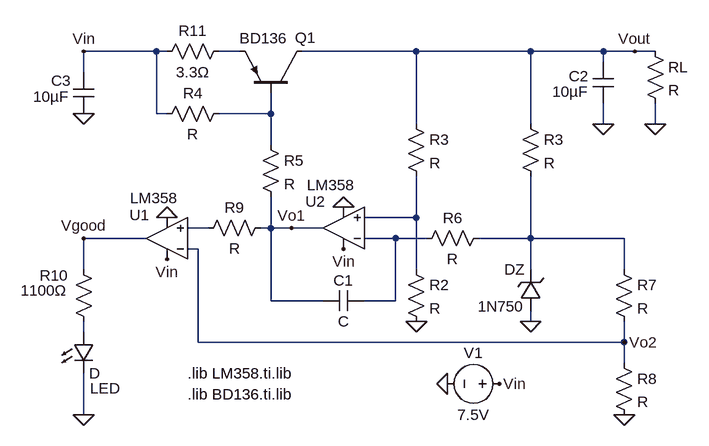
[diagram p0: schematic Lab 2 - t.asc]
Lab 2 - t.asc, the LTspice schematic file:
Version 4
SHEET 1 880 680
WIRE 48 48 -64 48
WIRE 64 48 48 48
WIRE 176 48 144 48
WIRE 448 48 272 48
WIRE 624 48 448 48
WIRE 736 48 624 48
WIRE 784 48 736 48
WIRE 816 48 784 48
WIRE 736 64 736 48
WIRE -64 80 -64 48
WIRE 48 144 48 48
WIRE 64 144 48 144
WIRE 224 144 224 112
WIRE 224 144 144 144
WIRE 448 160 448 48
WIRE 624 160 624 48
WIRE 736 160 736 128
WIRE 816 160 816 128
WIRE 224 192 224 144
WIRE 448 304 448 240
WIRE 448 304 368 304
WIRE 128 320 96 320
WIRE 224 320 224 272
WIRE 224 320 208 320
WIRE 256 320 224 320
WIRE 304 320 256 320
WIRE 32 336 -64 336
WIRE 416 336 368 336
WIRE 464 336 416 336
WIRE 624 336 624 240
WIRE 624 336 544 336
WIRE 768 336 624 336
WIRE 112 352 96 352
WIRE -64 384 -64 336
WIRE 448 384 448 304
WIRE 624 384 624 336
WIRE 768 384 768 336
WIRE 224 432 224 320
WIRE 304 432 224 432
WIRE 416 432 416 336
WIRE 416 432 368 432
WIRE 624 464 624 448
WIRE -64 480 -64 464
WIRE 112 496 112 352
WIRE 768 496 768 464
WIRE 768 496 112 496
WIRE 768 528 768 496
WIRE -64 608 -64 544
FLAG 624 464 0
FLAG 448 464 0
FLAG 816 160 0
FLAG 736 160 0
FLAG -64 144 0
FLAG -64 608 0
FLAG 768 608 0
FLAG 784 48 Vout
FLAG -64 336 Vgood
FLAG 768 496 Vo2
FLAG 256 320 Vo1
FLAG 336 352 Vin
FLAG 64 368 Vin
FLAG 64 304 0
FLAG 336 288 0
FLAG -64 48 Vin
FLAG 496 560 0
FLAG 576 560 Vin
SYMBOL cap -80 80 R0
WINDOW 0 -34 13 Left 2
WINDOW 3 -62 38 Left 2
SYMATTR InstName C3
SYMATTR Value 10µF
SYMBOL res 160 32 R90
WINDOW 0 0 56 VBottom 2
WINDOW 3 32 56 VTop 2
SYMATTR InstName R11
SYMATTR Value 3.3Ω
SYMBOL res 160 128 R90
WINDOW 0 0 56 VBottom 2
WINDOW 3 32 56 VTop 2
SYMATTR InstName R4
SYMBOL pnp 272 112 M270
WINDOW 0 85 11 VLeft 2
WINDOW 3 84 96 VLeft 2
SYMATTR InstName Q1
SYMATTR Value BD136
SYMBOL res 208 176 R0
SYMATTR InstName R5
SYMBOL OpAmps\\opamp2 64 400 R180
WINDOW 0 27 100 Left 2
WINDOW 3 -18 126 Left 2
SYMATTR InstName U1
SYMATTR Value LM358
SYMBOL cap 368 416 R90
WINDOW 0 0 32 VBottom 2
WINDOW 3 32 32 VTop 2
SYMATTR InstName C1
SYMBOL OpAmps\\opamp2 336 384 R180
WINDOW 0 28 105 Left 2
WINDOW 3 -18 130 Left 2
SYMATTR InstName U2
SYMATTR Value LM358
SYMBOL res 560 320 R90
WINDOW 0 0 56 VBottom 2
WINDOW 3 32 56 VTop 2
SYMATTR InstName R6
SYMBOL zener 640 448 R180
WINDOW 0 24 64 Left 2
WINDOW 3 26 7 Left 2
SYMATTR InstName DZ
SYMATTR Value 1N750
SYMBOL res 432 368 R0
SYMATTR InstName R2
SYMBOL res 432 144 R0
SYMATTR InstName R3
SYMBOL res 608 144 R0
SYMATTR InstName R3
SYMBOL res 800 32 R0
SYMATTR InstName RL
SYMBOL cap 720 64 R0
WINDOW 0 -37 22 Left 2
WINDOW 3 -63 46 Left 2
SYMATTR InstName C2
SYMATTR Value 10µF
SYMBOL res 752 368 R0
SYMATTR InstName R7
SYMBOL res 752 512 R0
SYMATTR InstName R8
SYMBOL res -80 368 R0
WINDOW 0 -52 25 Left 2
WINDOW 3 -81 48 Left 2
SYMATTR InstName R10
SYMATTR Value 1100Ω
SYMBOL LED -80 480 R0
WINDOW 0 26 87 Left 2
SYMATTR InstName LED
SYMBOL res 224 304 R90
WINDOW 0 0 56 VBottom 2
WINDOW 3 32 56 VTop 2
SYMATTR InstName R9
SYMBOL voltage 592 560 R90
WINDOW 0 -32 56 VBottom 2
WINDOW 3 32 56 VTop 2
SYMATTR InstName V1
SYMATTR Value 7.5V
TEXT 96 544 Left 2 !.lib LM358.ti.lib
TEXT 96 576 Left 2 !.lib BD136.ti.lib

The netlist it stands for:
* Lab 2 - t.asc
C3 Vin 0 10µF
R11 N001 Vin 3.3Ω
R4 N002 Vin R
Q1 Vout N002 N001 0 BD136
R5 N002 Vo1 R
XU1 N004 Vo2 Vin 0 Vgood LM358  ; pins In+ In- V+ V- OUT
C1 N005 Vo1 C
XU2 N003 N005 Vin 0 Vo1 LM358  ; pins In+ In- V+ V- OUT
R6 N006 N005 R
DZ 0 N006 1N750
R2 N003 0 R
R3 Vout N003 R
R3 Vout N006 R
RL Vout 0 R
C2 Vout 0 10µF
R7 N006 Vo2 R
R8 Vo2 0 R
R10 Vgood N007 1100Ω
D§LED N007 0 D
R9 Vo1 N004 R
V1 Vin 0 7.5V
.model D D
.lib standard.dio
.model NPN NPN
.model PNP PNP
.lib standard.bjt
.lib LM358.ti.lib
.lib BD136.ti.lib
.backanno
.end